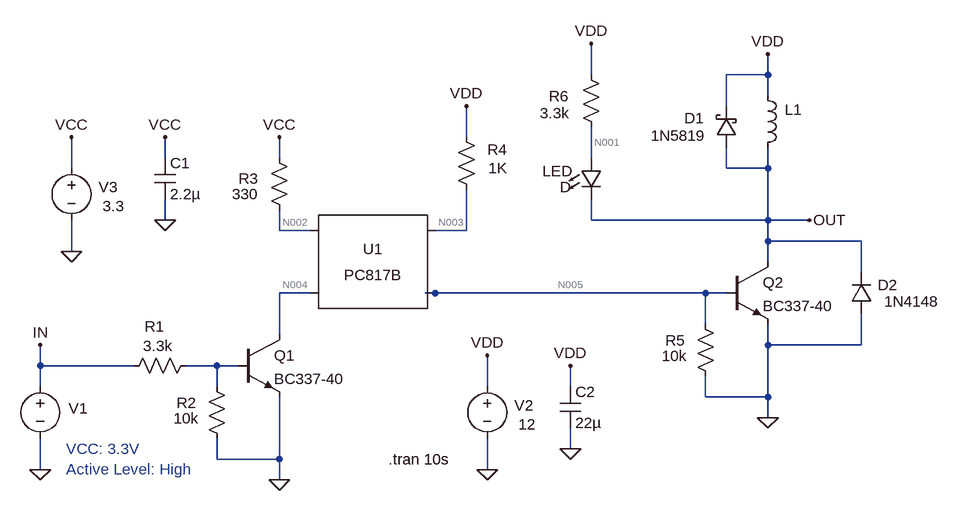
[diagram p0: schematic v2.1.asc]
v2.1.asc, the LTspice schematic file:
Version 4.1
SHEET 1 1332 680
WIRE 560 -112 560 -160
WIRE 832 -112 832 -144
WIRE 832 -112 768 -112
WIRE 832 -80 832 -112
WIRE 768 -64 768 -112
WIRE 368 -16 368 -64
WIRE -96 16 -96 -16
WIRE 80 16 80 -16
WIRE 560 16 560 -32
WIRE -240 32 -240 -16
WIRE 768 32 768 0
WIRE 832 32 832 0
WIRE 832 32 768 32
WIRE -96 112 -96 80
WIRE 560 112 560 80
WIRE 832 112 832 32
WIRE 832 112 560 112
WIRE 896 112 832 112
WIRE 80 128 80 96
WIRE 128 128 80 128
WIRE 368 128 368 64
WIRE 368 128 320 128
WIRE 832 144 832 112
WIRE 976 144 832 144
WIRE -240 160 -240 112
WIRE 832 176 832 144
WIRE 976 192 976 144
WIRE 128 224 80 224
WIRE 320 224 304 224
WIRE 736 224 320 224
WIRE 768 224 736 224
WIRE 736 272 736 224
WIRE 80 288 80 224
WIRE 832 304 832 272
WIRE 976 304 976 256
WIRE 976 304 832 304
WIRE -288 336 -288 304
WIRE -144 336 -288 336
WIRE -16 336 -64 336
WIRE 16 336 -16 336
WIRE -288 368 -288 336
WIRE -16 368 -16 336
WIRE 400 368 400 320
WIRE 528 368 528 336
WIRE 736 384 736 352
WIRE 832 384 832 304
WIRE 832 384 736 384
WIRE 832 416 832 384
WIRE 528 464 528 432
WIRE -16 480 -16 448
WIRE 80 480 80 384
WIRE 80 480 -16 480
WIRE -288 496 -288 448
WIRE 400 496 400 448
WIRE 80 512 80 480
FLAG 80 512 0
FLAG -288 496 0
FLAG 400 496 0
FLAG -288 304 IN
FLAG 832 416 0
FLAG 400 320 VDD
FLAG 368 -64 VDD
FLAG 832 -144 VDD
FLAG 896 112 OUT
FLAG 560 -160 VDD
FLAG -240 160 0
FLAG -240 -16 VCC
FLAG 80 -16 VCC
FLAG -96 112 0
FLAG -96 -16 VCC
FLAG 528 464 0
FLAG 528 336 VDD
SYMBOL Optos\\PC817B 224 176 R0
SYMATTR InstName U1
SYMBOL res 352 -32 R0
WINDOW 0 48 35 Left 2
WINDOW 3 50 64 Left 2
SYMATTR InstName R4
SYMATTR Value 1K
SYMBOL voltage -288 352 R0
WINDOW 123 0 0 Left 0
WINDOW 39 0 0 Left 0
WINDOW 0 44 50 Left 2
WINDOW 3 44 78 Invisible 2
SYMATTR InstName V1
SYMATTR Value PULSE(0 3.3 2 1n 1n 2 4)
SYMBOL res 96 112 R180
WINDOW 0 48 64 Left 2
WINDOW 3 48 40 Left 2
SYMATTR InstName R3
SYMATTR Value 330
SYMBOL voltage 400 352 R0
WINDOW 123 0 0 Left 0
WINDOW 39 0 0 Left 0
WINDOW 0 42 45 Left 2
WINDOW 3 48 74 Left 2
SYMATTR InstName V2
SYMATTR Value 12
SYMBOL npn 768 176 R0
SYMATTR InstName Q2
SYMATTR Value BC337-40
SYMBOL res 720 256 R0
WINDOW 0 -46 41 Left 2
WINDOW 3 -51 65 Left 2
SYMATTR InstName R5
SYMATTR Value 10k
SYMBOL ind 816 -96 R0
WINDOW 3 39 80 Invisible 2
WINDOW 0 42 38 Left 2
SYMATTR Value 25m
SYMATTR InstName L1
SYMATTR SpiceLine Rser=100
SYMBOL diode 992 256 R180
WINDOW 0 -40 44 Left 2
WINDOW 3 -104 19 Left 2
SYMATTR InstName D2
SYMATTR Value 1N4148
SYMBOL LED 544 16 R0
WINDOW 0 -59 20 Left 2
WINDOW 3 -32 45 Left 2
SYMATTR InstName LED
SYMBOL res 544 -128 R0
WINDOW 0 -49 49 Left 2
WINDOW 3 -63 75 Left 2
SYMATTR InstName R6
SYMATTR Value 3.3k
SYMBOL schottky 784 0 R180
WINDOW 0 50 45 Left 2
WINDOW 3 47 18 Left 2
SYMATTR InstName D1
SYMATTR Value 1N5819
SYMBOL npn 16 288 R0
SYMATTR InstName Q1
SYMATTR Value BC337-40
SYMBOL voltage -240 16 R0
WINDOW 123 0 0 Left 0
WINDOW 39 0 0 Left 0
WINDOW 0 42 45 Left 2
WINDOW 3 48 74 Left 2
SYMATTR InstName V3
SYMATTR Value 3.3
SYMBOL res -48 320 R90
WINDOW 0 -29 64 VBottom 2
WINDOW 3 -30 59 VTop 2
SYMATTR InstName R1
SYMATTR Value 3.3k
SYMBOL cap -112 16 R0
SYMATTR InstName C1
SYMATTR Value 2.2µ
SYMBOL cap 512 368 R0
SYMATTR InstName C2
SYMATTR Value 22µ
SYMBOL res -32 352 R0
WINDOW 0 -46 41 Left 2
WINDOW 3 -51 65 Left 2
SYMATTR InstName R2
SYMATTR Value 10k
TEXT 248 480 Left 2 !.tran 10s
TEXT -248 464 Left 2 ;VCC: 3.3V\nActive Level: High

The netlist it stands for:
* v2.1.asc
X§U1 N002 N004 N003 N005 PC817 Igain=1.5m
R4 VDD N003 1K
V1 IN 0 PULSE(0 3.3 2 1n 1n 2 4)
R3 N002 VCC 330
V2 VDD 0 12
Q2 OUT N005 0 0 BC337-40
R5 N005 0 10k
L1 VDD OUT 25m Rser=100
D2 0 OUT 1N4148
D§LED N001 OUT D
R6 VDD N001 3.3k
D1 OUT VDD 1N5819
Q1 N004 N006 0 0 BC337-40
V3 VCC 0 3.3
R1 N006 IN 3.3k
C1 VCC 0 2.2µ
C2 VDD 0 22µ
R2 N006 0 10k
.model D D
.lib standard.dio
.model NPN NPN
.model PNP PNP
.lib standard.bjt
.tran 10s
* VCC: 3.3V
* Active Level: High
.lib PC817.sub
.backanno
.end

* Results of the author's LTspice run, read from the files saved beside the schematic
* Operating Point, zero values left out:
*   V(n001) = 12 V
*   V(n002) = 3.3 V
*   V(n003) = 12 V
*   V(n004) = 2.8 V
*   V(n005) = 609.8 nV
*   V(out) = 12 V
*   V(vcc) = 3.3 V
*   V(vdd) = 12 V
*   I(D1) = -208.5 pA
*   I(D2) = -2.532 nA
*   I(L1) = 2.336 nA
*   I(R1) = 2.157 pA
*   I(R3) = -2.949 pA
*   I(R4) = 48.91 pA
*   I(R5) = 60.98 pA
*   I(V1) = 2.157 pA
*   I(V2) = -2.593 nA
*   I(V3) = -2.949 pA
*   Ib(Q1) = -2.869 pA
*   Ib(Q2) = -12.07 pA
*   Ic(Q1) = 2.949 pA
*   Ic(Q2) = 12.15 pA
*   Ix(u1:1) = 2.949 pA
*   Ix(u1:2) = -2.95 pA
*   Ix(u1:3) = 48.92 pA
*   Ix(u1:4) = -48.91 pA
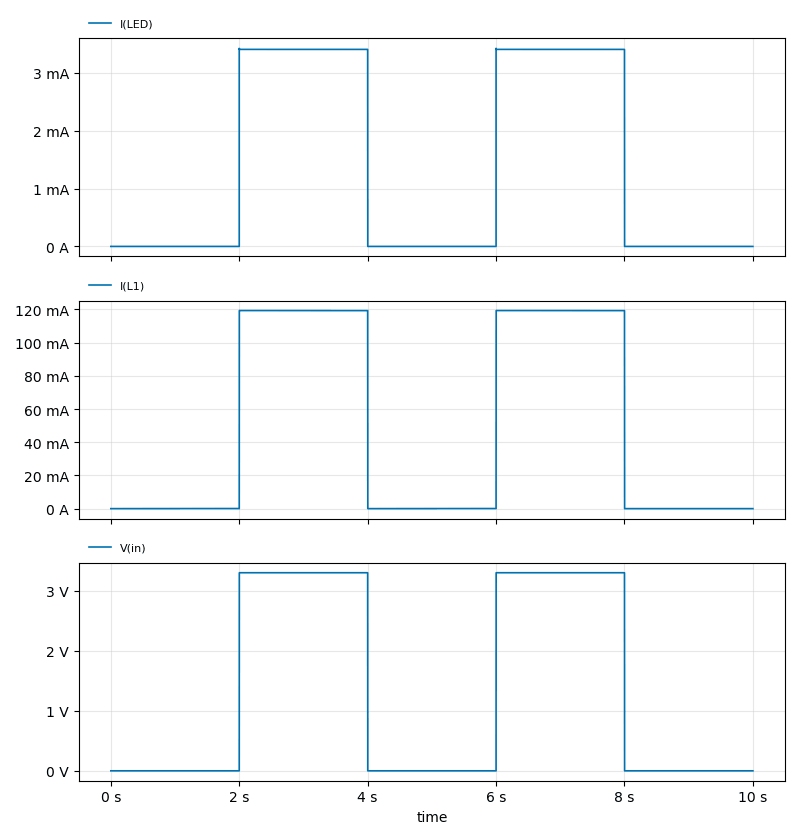
[diagram p1: Transient Analysis of v2.1.asc, plotted from the saved traces]
* Transient Analysis, 1 run:
*   I(LED): min 0 A, max 3.426 mA, average 1.363 mA, rms 2.156 mA, last 0 A
*   I(L1): min -43.21 nA, max 119.4 mA, average 47.74 mA, rms 75.48 mA, last 0 A
*   V(in): min 0 V, max 3.3 V, average 1.32 V, rms 2.087 V, last 0 V